# EAGLE design 10DOF_FeatherWing (EAGLE 7.5.0)
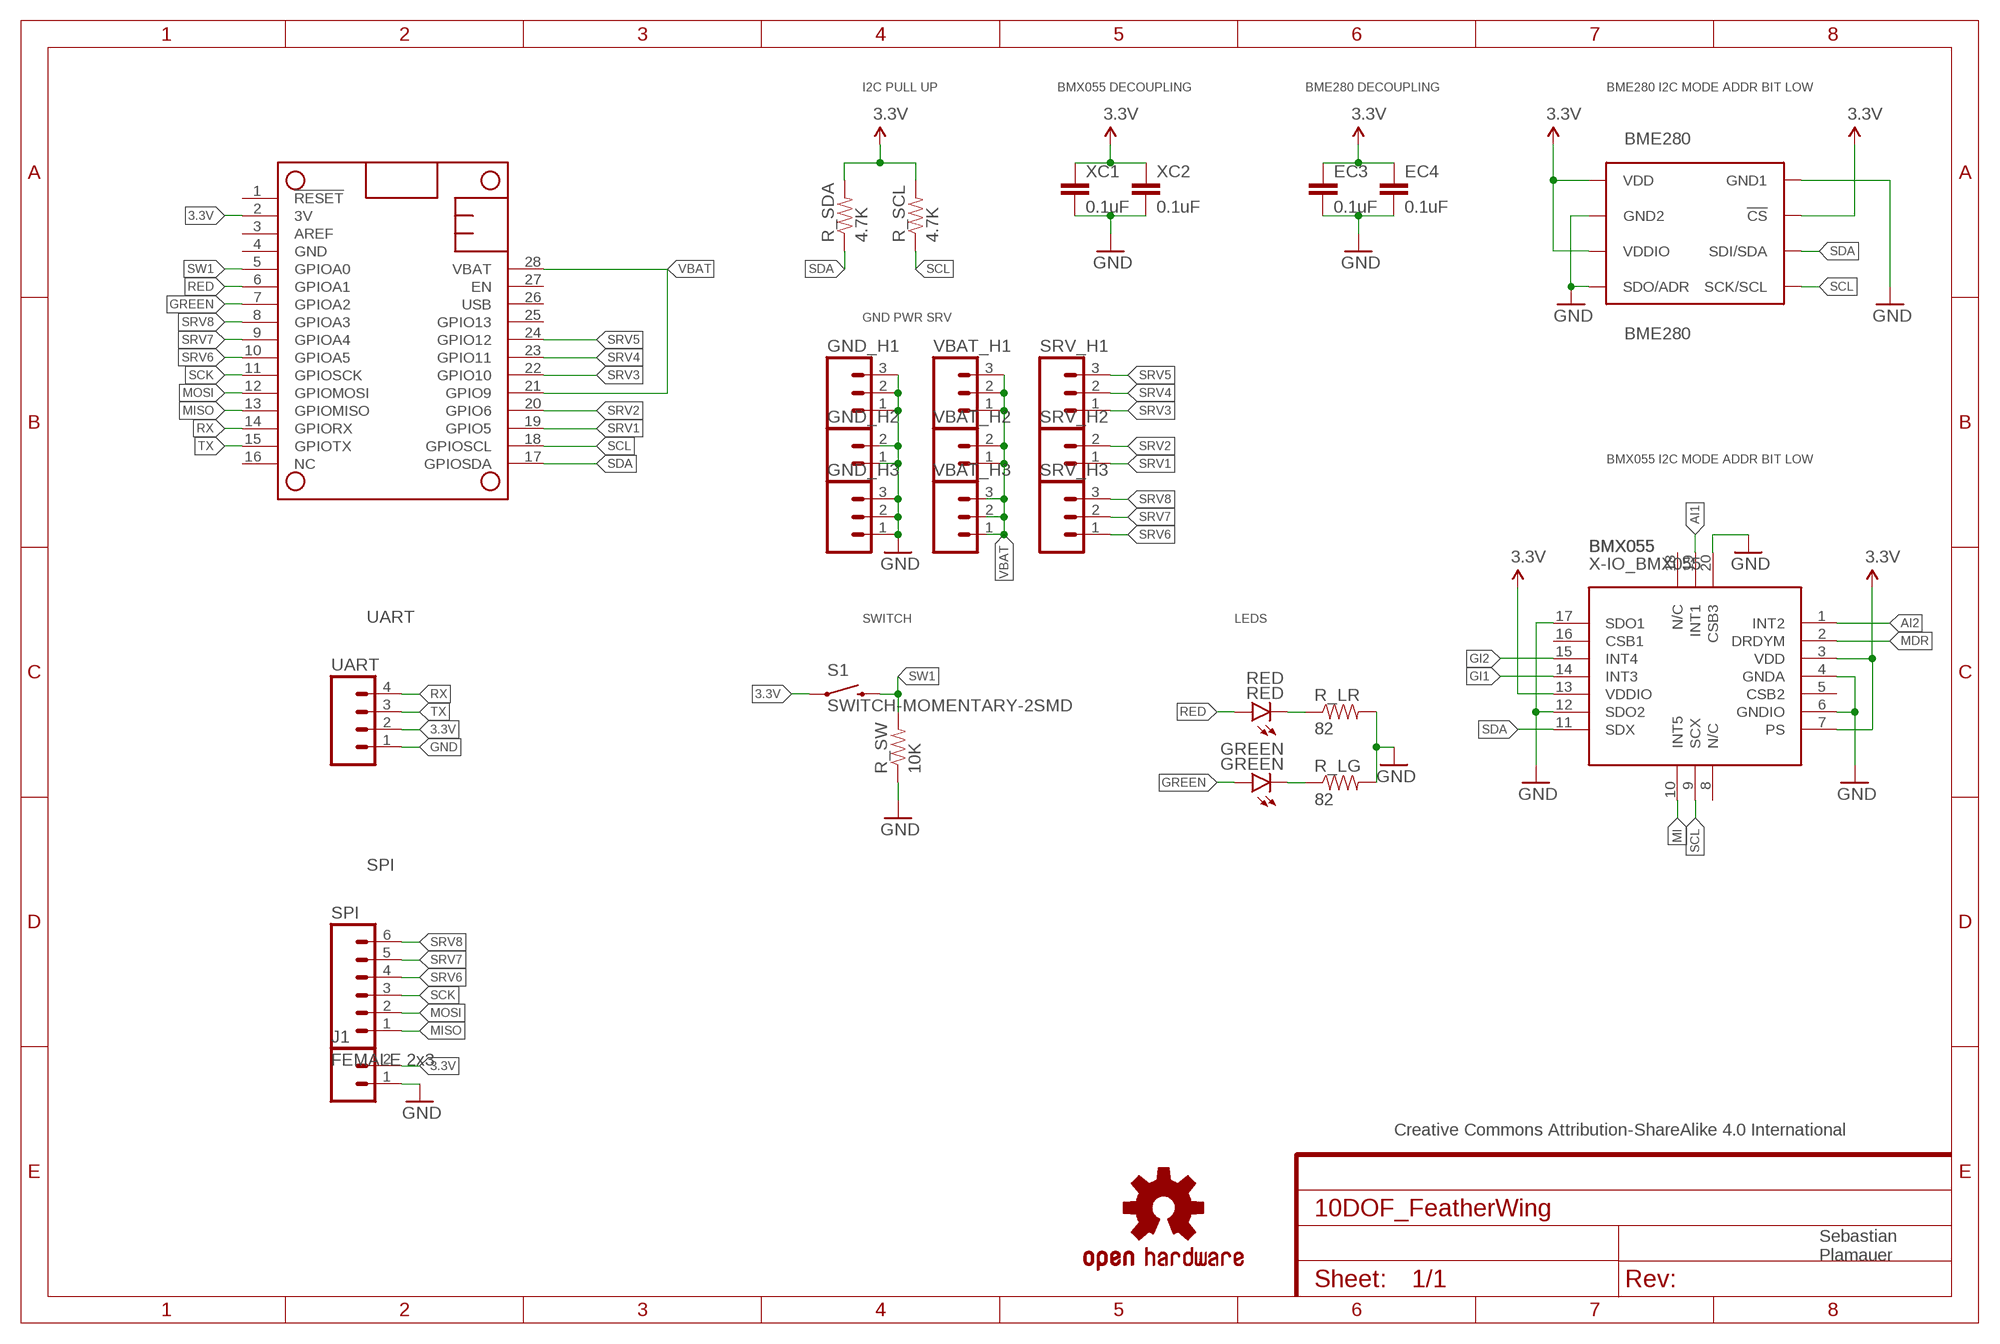
[diagram p0: schematic, sheet 1]

## Parts
BME280  BME280  BME280COMPONENTLIBRARY_BME280  [BME280COMPONENTLIBRARY_BME280_LGA]
BMX055  X-IO_BMX055  [X-IO_BMX055]
EC3  0.1uF  0.1UF-25V(+80/-20%)(0603)  [0603-CAP]
EC4  0.1uF  0.1UF-25V(+80/-20%)(0603)  [0603-CAP]
GND_H1  M03PTH  [1X03]
GND_H2  M02PTH  [1X02]
GND_H3  M03PTH  [1X03]
GREEN  GREEN  LED-GREEN0603  [LED-0603]
J1  M02PTH  [1X02]
LOGO1  OSHW-LOGOS  [OSHW-LOGO-S]
MS1  FEATHERWING  [FEATHERWING]
R_LG  82  82OHM-1/10W-1%(0603)SMD  [0603-RES]
R_LR  82  82OHM-1/10W-1%(0603)SMD  [0603-RES]
R_SCL  4.7K  4.7KOHM-1/10W-1%(0603)  [0603-RES]
R_SDA  4.7K  4.7KOHM-1/10W-1%(0603)  [0603-RES]
R_SW  10K  10KOHM-1/10W-1%(0603)0603  [0603-RES]
RED  RED  LED-RED0603  [LED-0603]
S1  SWITCH-MOMENTARY-2SMD  [TACTILE-SWITCH-SMD]
SPI  FEMALE 2x3  M06SILK_FEMALE_PTH  [1X06]
SRV_H1  M03PTH  [1X03]
SRV_H2  M02PTH  [1X02]
SRV_H3  M03PTH  [1X03]
UART  M04PTH  [1X04]
VBAT_H1  M03PTH  [1X03]
VBAT_H2  M02PTH  [1X02]
VBAT_H3  M03PTH  [1X03]
XC1  0.1uF  0.1UF-25V(+80/-20%)(0603)  [0603-CAP]
XC2  0.1uF  0.1UF-25V(+80/-20%)(0603)  [0603-CAP]

## Nets
3.3V: BME280.P$2(!CS) BME280.P$6(VDDIO) BME280.P$8(VDD) BMX055.3(VDD) BMX055.7(PS) BMX055.13(VDDIO) EC3.1 EC4.1 J1.2 MS1.2(3V) R_SCL.2 R_SDA.2 S1.1 UART.2 XC1.1 XC2.1
AI1: BMX055.19(INT1)
AI2: BMX055.1(INT2)
GI1: BMX055.14(INT3)
GI2: BMX055.15(INT4)
GND: BME280.P$1(GND1) BME280.P$5(SDO/ADR) BME280.P$7(GND2) BMX055.4(GNDA) BMX055.6(GNDIO) BMX055.12(SDO2) BMX055.17(SDO1) BMX055.20(CSB3) EC3.2 EC4.2 GND_H1.1 GND_H1.2 GND_H1.3 GND_H2.1 GND_H2.2 GND_H3.1 GND_H3.2 GND_H3.3 J1.1 R_LG.2 R_LR.2 R_SW.1 UART.1 XC1.2 XC2.2
GREEN: GREEN.A MS1.7(GPIOA2)
MDR: BMX055.2(DRDYM)
MI: BMX055.10(INT5)
MISO: MS1.13(GPIOMISO) SPI.1
MOSI: MS1.12(GPIOMOSI) SPI.2
N$4: GREEN.C R_LG.1
N$5: R_LR.1 RED.C
RED: MS1.6(GPIOA1) RED.A
RX: MS1.14(GPIORX) UART.4
SCK: MS1.11(GPIOSCK) SPI.3
SCL: BME280.P$4(SCK/SCL) BMX055.9(SCX) MS1.18(GPIOSCL) R_SCL.1
SDA: BME280.P$3(SDI/SDA) BMX055.11(SDX) MS1.17(GPIOSDA) R_SDA.1
SRV1: MS1.19(GPIO5) SRV_H2.1
SRV2: MS1.20(GPIO6) SRV_H2.2
SRV3: MS1.22(GPIO10) SRV_H1.1
SRV4: MS1.23(GPIO11) SRV_H1.2
SRV5: MS1.24(GPIO12) SRV_H1.3
SRV6: MS1.10(GPIOA5) SPI.4 SRV_H3.1
SRV7: MS1.9(GPIOA4) SPI.5 SRV_H3.2
SRV8: MS1.8(GPIOA3) SPI.6 SRV_H3.3
SW1: MS1.5(GPIOA0) R_SW.2 S1.3
TX: MS1.15(GPIOTX) UART.3
VBAT: MS1.21(GPIO9) MS1.28(VBAT) VBAT_H1.1 VBAT_H1.2 VBAT_H1.3 VBAT_H2.1 VBAT_H2.2 VBAT_H3.1 VBAT_H3.2 VBAT_H3.3
Unconnected: BMX055.5(CSB2) BMX055.8(N/C) BMX055.16(CSB1) BMX055.18(N/C) MS1.1(!RESET) MS1.3(AREF) MS1.16(NC) MS1.25(GPIO13) MS1.26(USB) MS1.27(EN)

## Notes on the sheet
- I2C PULL UP | BMX055 DECOUPLING | BME280 DECOUPLING | BME280 I2C MODE ADDR BIT LOW
- GND PWR SRV
- BMX055 I2C MODE ADDR BIT LOW
- UART | SWITCH | LEDS
- SPI
- Creative Commons Attribution-ShareAlike 4.0 International
- Sebastian
  Plamauer

## Power pins joined to a net without a drawn wire
GND: MS1.4(GND)

## Library data of the parts
BME280 = SparkFun_BME280_Breakout_v10:BME280COMPONENTLIBRARY_BME280; PROD_ID: IC-13090
BMX055 = BMX055 Breakout:X-IO_BMX055
EC3 EC4 XC1 XC2 = SparkFun-Capacitors:0.1UF-25V(+80/-20%)(0603): CAP-00810 Ceramic Standard decoupling cap; PROD_ID: CAP-00810
GND_H1 GND_H3 SRV_H1 SRV_H3 VBAT_H1 VBAT_H3 = SparkFun-Connectors:M03: Header 3 Standard 3-pin 0.1" header. Use with straight break away headers (SKU : PRT-00116), right angle break away headers (PRT-00553), swiss pins (PRT-00743), machine pins (PRT-00117), and female headers (PRT-00115). Molex polarized connector foot print use with SKU : PRT-08232 with associated crimp pins and housings.
GND_H2 J1 SRV_H2 VBAT_H2 = SparkFun-Connectors:M02: Standard 2-pin 0.1" header. Use with - straight break away headers ( PRT-00116) - right angle break away headers (PRT-00553) - swiss pins (PRT-00743) - machine pins (PRT-00117) - female headers (PRT-00115) Molex polarized connector foot print use with: PRT-08233 with associated crimp pins and housings. 2.54_SCREWTERM for use with PRT-10571. 3.5mm Screw Terminal footprints for PRT-08084 5mm Screw Terminal footprints for use with PRT-08432
GREEN = SparkFun-LED:LED-GREEN: Various green LEDs Green LEDs used in SFE Production 0603- DIO-00821 LARGE- DIO-00862 LILYPAD- DIO-09910; PROD_ID: DIO-00821
LOGO1 = SparkFun-Aesthetics:OSHW-LOGO: Open Source Hardware Logo This logo indicates the piece of hardware it is found on incorporates a OSHW license and/or adheres to the definition of open source hardware found here: http://freedomdefined.org/OSHW
MS1 = adafruit:FEATHERWING
R_LG R_LR = SparkFun-Resistors:82OHM-1/10W-1%(0603): RES-12311; PROD_ID: RES-12311
R_SCL R_SDA = SparkFun-Resistors:4.7KOHM-1/10W-1%(0603): RES-07857; PROD_ID: RES-07857
R_SW = SparkFun-Resistors:10KOHM-1/10W-1%(0603): RES-00824; PROD_ID: RES-00824
RED = SparkFun-LED:LED-RED: Assorted Red LEDs LilyPad 1206- DIO-09912 1206- DIO-00809 0603- DIO-00819 "SMART" means more efficient and expensive; PROD_ID: DIO-00819
S1 = SparkFun-Electromechanical:SWITCH-MOMENTARY-2: Various NO switches- pushbuttons, reed, etc; PROD_ID: SWCH-08247
SPI = SparkFun-Connectors:M06: Header 6 Standard 6-pin 0.1" header. Use with straight break away headers (SKU : PRT-00116), right angle break away headers (PRT-00553), swiss pins (PRT-00743), machine pins (PRT-00117), and female headers (PRT-00115). Molex polarized connector foot print use with SKU : PRT-08094 with associated crimp pins and housings. NOTES ON THE VARIANTS LOCK and LOCK_LONGPADS... This footprint was designed to help hold the alignment of a through-hole component (i.e. 6-pin header) while soldering it into place. You may notice that each hole has been shifted either up or down by 0.005 of an inch from it's more standard position (which is a perfectly straight line). This slight alteration caused the pins (the squares in the middle) to touch the edges of the holes. Because they are alternating, it causes a "brace" to hold the component in place. 0.005 has proven to be the perfect amount of "off-center" position when using our standard breakaway headers. Although looks a little odd when you look at the bare footprint, once you have a header in there, the alteration is very hard to notice. Also,if you push a header all the way into place, it is covered up entirely on the bottom side. This idea of altering the position of holes to aid alignment will be further integrated into the Sparkfun Library for other footprints. It can help hold any component with 3 or more connection pins.; PROD_ID: CONN-08437
UART = SparkFun-Connectors:M04: Header 4 Standard 4-pin 0.1" header. Use with straight break away headers (SKU : PRT-00116), right angle break away headers (PRT-00553), swiss pins (PRT-00743), machine pins (PRT-00117), and female headers (PRT-00115). Molex polarized connector foot print use with SKU : PRT-08231 with associated crimp pins and housings. 1MM SMD Version SKU: PRT-10208; PROD_ID: CONN-09696

## Board
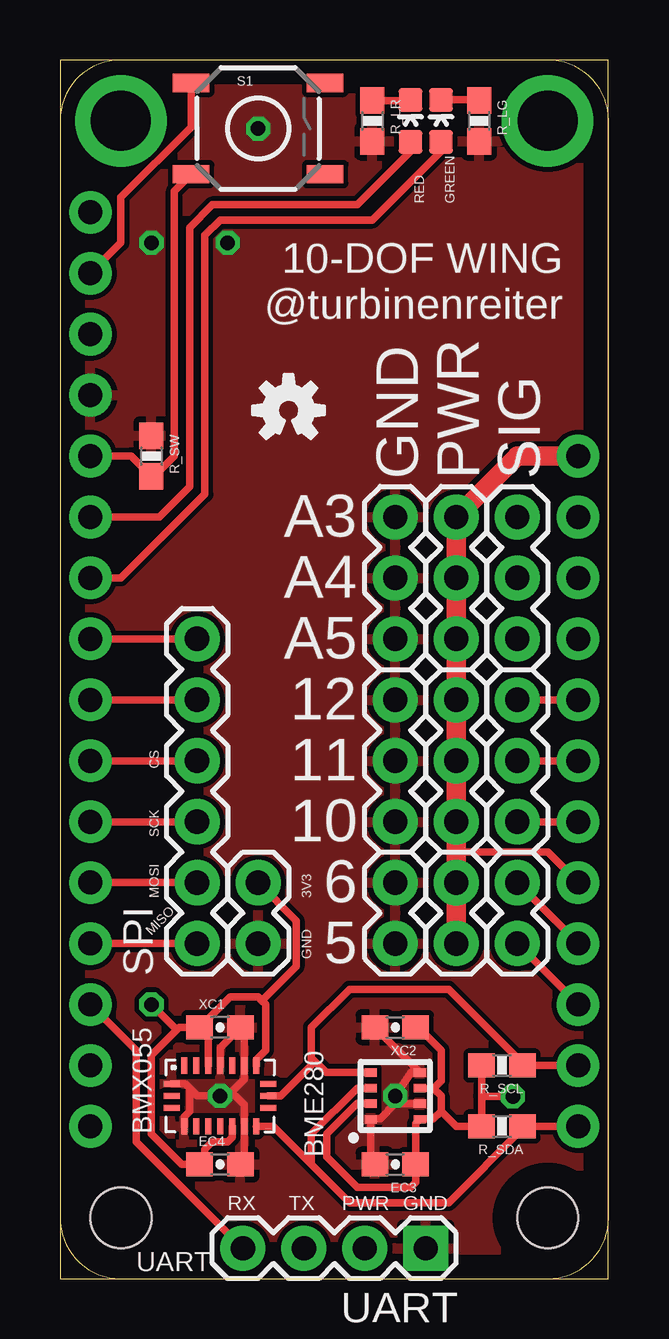
[diagram p1: board, top side]
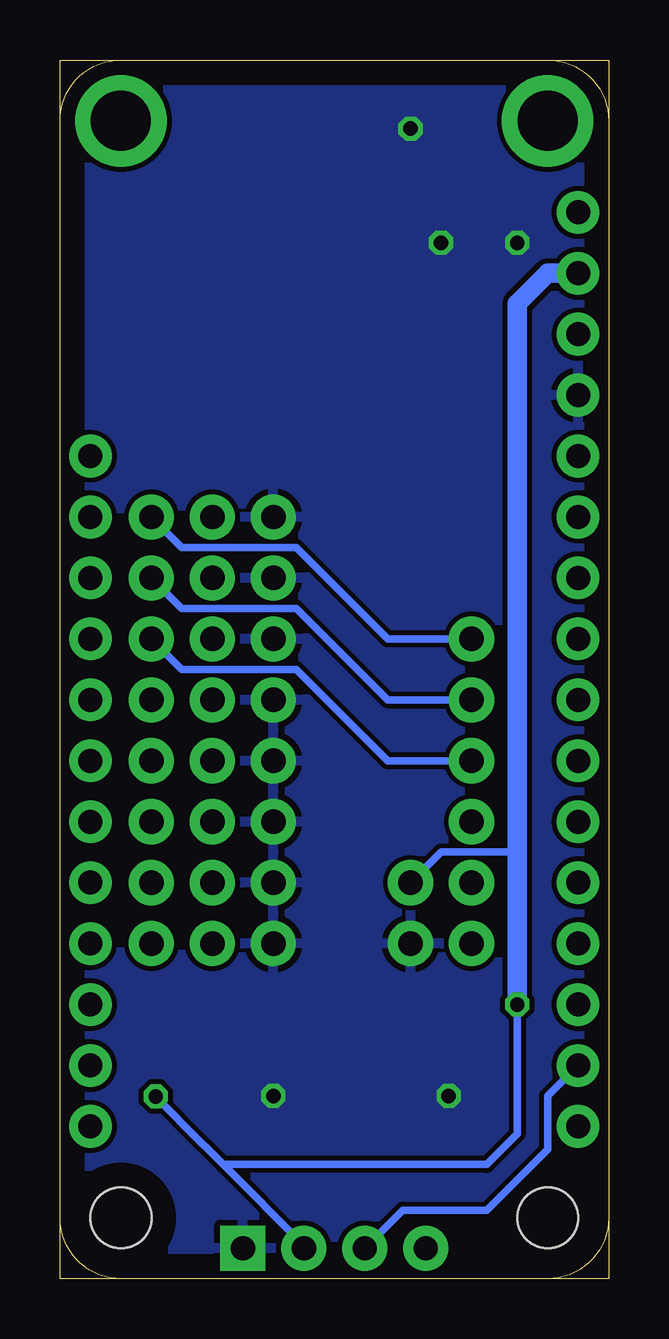
[diagram p2: board, bottom side, seen from below]

Size 22.86 x 50.8 mm. Coordinates in mm from the lower left corner, seen from the top.
Outline: 0,0 22.85,0 22.85,50.79 0,50.79 0,0
Copper layers (1*16): Top 0.035mm / dielectric 1.5mm / Bottom 0.035mm
Design rules "default": minimum track width 10mil, minimum drill 24mil, track to track 8mil, track to pad 8mil, pad to pad 8mil, via to via 8mil, smd to smd 8mil, copper to edge 40mil, drill to drill 8mil, minimum pad ring 10mil, minimum via ring 8mil, stop-mask expansion 4mil, vias tented up to drill 0mil, thermal gap 10mil

### Footprints (pad centres in the part's own frame; a part is rotated, then mirrored left to right if it is on the bottom)
BME280COMPONENTLIBRARY_BME280_LGA = smd 0.5 x 0.35: P$1 1.025,0.975; P$2 1.025,0.325; P$3 1.025,-0.325; P$4 1.025,-0.975; P$5 -1.025,-0.975; P$6 -1.025,-0.325; P$7 -1.025,0.325; P$8 -1.025,0.975
X-IO_BMX055 = smd 0.675 x 0.25: 1 1.262,1.5; 2 1.262,1; 3 1.262,0.5; 4 1.262,0; 5 1.262,-0.5; 6 1.262,-1; 7 1.262,-1.5; 11 -1.262,-1.5; 12 -1.262,-1; 13 -1.262,-0.5; 14 -1.262,0; 15 -1.262,0.5; 16 -1.262,1; 17 -1.262,1.5 | smd 0.25 x 0.675: 8 0.5,-2.013; 9 0,-2.013; 10 -0.5,-2.013; 18 -0.5,2.013; 19 0,2.013; 20 0.5,2.013
0603-CAP = smd 1.1 x 1: 1 -0.85,0; 2 0.85,0
1X03 = drill 1.016 pad 1.88: 1 0,0; 2 2.54,0; 3 5.08,0
1X02 = drill 1.016 pad 1.88: 1 0,0; 2 2.54,0
LED-0603 = smd 1 x 1: A 0,-0.877; C 0,0.877
FEATHERWING = drill 1 pad 1.778: 1 6.35,1.27; 2 8.89,1.27; 3 11.43,1.27; 4 13.97,1.27; 5 16.51,1.27; 6 19.05,1.27; 7 21.59,1.27; 8 24.13,1.27; 9 26.67,1.27; 10 29.21,1.27; 11 31.75,1.27; 12 34.29,1.27; 13 36.83,1.27; 14 39.37,1.27; 15 41.91,1.27; 16 44.45,1.27; 17 44.45,21.59; 18 41.91,21.59; 19 39.37,21.59; 20 36.83,21.59; 21 34.29,21.59; 22 31.75,21.59; 23 29.21,21.59; 24 26.67,21.59; 25 24.13,21.59; 26 21.59,21.59; 27 19.05,21.59; 28 16.51,21.59 | drill 2.5 pad 3.81: P$1 2.54,20.32; P$2 2.54,2.54 | hole 2.54: 48.26,20.32; 48.26,2.54
0603-RES = smd 1.1 x 1: 1 -0.85,0; 2 0.85,0
TACTILE-SWITCH-SMD = smd 1.524 x 0.762: 1 -2.794,1.905; 2 2.794,1.905; 3 -2.794,-1.905; 4 2.794,-1.905
1X06 = drill 1.016 pad 1.88: 1 0,0; 2 2.54,0; 3 5.08,0; 4 7.62,0; 5 10.16,0; 6 12.7,0
1X04 = drill 1.016 pad 1.88 square: 1 0,0 | drill 1.016 pad 1.88: 2 2.54,0; 3 5.08,0; 4 7.62,0

### Placement (x,y rotation side)
BME280  13.97,7.62 180 top
BMX055  6.67,7.62 90 top
EC3  13.97,4.76 180 top
EC4  6.67,4.76 0 top
GND_H1  13.97,19.05 90 top
GND_H2  13.97,13.97 90 top
GND_H3  13.97,26.67 90 top
GREEN  15.88,48.26 0 top
J1  8.26,13.97 90 top
LOGO1  9.53,36.2 0 top
MS1  0,50.8 270 top
R_LG  17.46,48.26 270 top
R_LR  13.02,48.26 270 top
R_SCL  18.41,8.89 180 top
R_SDA  18.41,6.35 180 top
R_SW  3.81,34.29 270 top
RED  14.61,48.26 0 top
S1  8.26,47.94 0 top
SPI  5.71,13.97 90 top
SRV_H1  19.05,19.05 90 top
SRV_H2  19.05,13.97 90 top
SRV_H3  19.05,26.67 90 top
UART  15.24,1.27 180 top
VBAT_H1  16.51,19.05 90 top
VBAT_H2  16.51,13.97 90 top
VBAT_H3  16.51,26.67 90 top
XC1  6.67,10.48 0 top
XC2  13.97,10.48 180 top

### Tracks (layer width: path | path; a pad name or v marks a point on that pad's centre or on a via)
3.3V  (via drill 0.6)
  Top 0.305: 15.88,6.99 15.88,7.62 15.55,7.95 BME280.P$6 15.56,7.95 15.88,8.26 15.88,9.53 14.92,10.48 XC2.1 | 15.88,6.99 15.56,6.67 15.02,6.67 BME280.P$8 14.82,6.47 EC3.1 14.82,4.03 14.61,3.81 12.38,3.81 11.11,5.08 11.11,6.03 12.38,7.3 12.94,7.3 BME280.P$2 | R_SCL.2 17.57,7.62 | 17.57,7.62 R_SDA.2 16.51,6.35 15.88,6.99 | BMX055.3 6.17,10.13 XC1.1 | v18.87,7.6 17.59,7.6 17.57,7.62 | BMX055.7 8.17,9.12 8.57,9.53 8.57,11.43 8.41,11.59 | 8.41,11.59 8.26,11.75 7.09,11.75 XC1.1 | S1.1 5.46,48.01 2.54,45.09 2.54,43.18 MS1.2 | BMX055.13 7.17,5.9 6.99,5.71 6.35,5.71 6.03,5.4 6.03,4.98 EC4.1 5.08,4.76 3.81,6.03 3.81,9.31 4.98,10.48 XC1.1 | J1.2 9.84,14.92 9.84,13.02 8.41,11.59 | v3.81,11.43 4.76,10.48
  Bottom 0.305: 16.06,4.76 5.08,4.76 3.81,6.03 v3.81,11.43 | 16.06,4.76 17.6,6.3 v18.87,7.6 | UART.2 12.7,1.4 16.06,4.76 | J1.2 6.99,17.78 3.81,17.78
  Bottom 0.813: MS1.2 2.54,41.91 3.81,40.64 3.81,17.78 v3.81,11.43
GND  (via drill 0.6)
  Top 0.305: EC4.2 7.67,4.91 BMX055.12 7.67,7.25 7.3,7.62 | BMX055.20 5.21,8.12 5.4,7.94 | BMX055.17 5.17,6.75 5.4,6.99 5.4,7.94 | BMX055.4 6.67,9.63 XC1.2 7.67,10.33 BMX055.6 7.67,8.3 7.04,7.68 7.3,7.62 | EC3.2 12.95,5.25 BME280.P$1 12.97,6.67 13.34,6.67 13.97,7.3 | XC2.2 BME280.P$5 14.63,8.6 v13.97,7.62 13.97,7.3 | BME280.P$7 13.98,7.29 13.97,7.3 | 7.3,7.62 v6.67,7.62 5.71,7.62 5.4,7.94
  other vias: 8.26,47.94 3.81,43.18 6.99,43.18
  pour Top: 23.81,-0.64 23.81,51.44 -0.64,51.44 -0.64,-0.64
  pour Bottom: 0,0 23.18,0 23.18,50.8 0,50.8
GREEN
  Top 0.305: GREEN.A 15.88,46.99 13.02,44.13 6.67,44.13 6.03,43.5 6.03,32.7 2.54,29.21 MS1.7
MISO
  Top 0.305: MS1.13 3.17,13.97 SPI.1
MOSI
  Top 0.305: MS1.12 SPI.2
N$4
  Top 0.305: GREEN.C 17.44,49.14 R_LG.1
N$5
  Top 0.305: R_LR.1 14.58,49.11 RED.C
RED
  Top 0.305: RED.A 14.61,46.99 12.38,44.77 6.35,44.77 5.4,43.81 5.4,33.02 4.13,31.75 MS1.6
RX
  Top 0.305: MS1.14 3.17,9.53 3.17,5.71 UART.4
SCK
  Top 0.305: MS1.11 SPI.3
SCL
  Top 0.305: MS1.18 R_SCL.1 19.27,8.99 16.19,12.06 12.06,12.06 10.48,10.48 10.48,9.21 | 10.48,9.21 10.48,8.89 9.21,7.62 BMX055.9 | BME280.P$4 11.09,8.6 10.48,9.21
SDA
  Top 0.305: MS1.17 R_SDA.1 19.27,6.25 16.19,3.17 12.06,3.17 10.48,4.76 | BMX055.11 8.88,6.36 10.48,4.76 | BME280.P$3 12.39,7.95 10.48,6.03 10.48,4.76
SRV1
  Top 0.305: MS1.19 SRV_H2.1
SRV2
  Top 0.305: MS1.20 SRV_H2.2
SRV3
  Top 0.305: MS1.22 SRV_H1.1
SRV4
  Top 0.305: MS1.23 SRV_H1.2
SRV5
  Top 0.305: MS1.24 SRV_H1.3
SRV6
  Top 0.305: MS1.10 SPI.4
  Bottom 0.305: SPI.4 9.21,21.59 13.02,25.4 17.78,25.4 SRV_H3.1
SRV7
  Top 0.305: SPI.5 MS1.9
  Bottom 0.305: SRV_H3.2 17.78,27.94 13.02,27.94 9.21,24.13 SPI.5
SRV8
  Top 0.305: MS1.8 SPI.6
  Bottom 0.305: SPI.6 9.21,26.67 13.02,30.48 17.78,30.48 SRV_H3.3
SW1
  Top 0.305: MS1.5 2.96,34.29 R_SW.2 3.91,33.44 4.76,34.29 4.76,45.34 S1.3
TX
  Bottom 0.305: UART.3 8.57,2.86 5.08,2.86 2.54,5.4 2.54,7.62 MS1.15
VBAT
  Top 0.305: MS1.21 20.32,17.78 16.51,17.78
  Top 0.813: VBAT_H2.1 VBAT_H2.2 16.51,17.78 VBAT_H1.1 VBAT_H1.2 VBAT_H1.3 VBAT_H3.1 VBAT_H3.2 VBAT_H3.3 19.05,34.29 MS1.28

### Text on the board
tNames: 10-DOF WING / @turbinenreiter | A3 | GND | PWR | SIG | A4 | A5 | 12 | 11 | CS | 10 | SCK | 6 | MOSI | 3V3 | 5 | MISO | GND | RX | TX | PWR | GND | UART